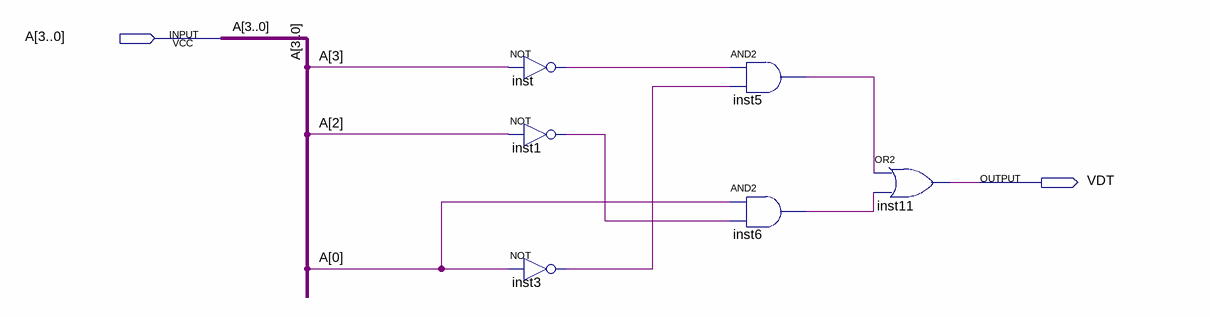
[diagram p0: schematic sheet]
// Quartus schematic assignment5a.bdf as structural Verilog: 6 symbols, 2 pins
module assignment5a (
  input  [3:0] A,
  output VDT
);

  wire inst1_out, inst3_out, inst5_out, inst6_out, inst_out;

  not inst (inst_out, A[3]);
  not inst1 (inst1_out, A[2]);
  not inst3 (inst3_out, A[0]);
  and inst5 (inst5_out, inst_out, inst3_out);
  and inst6 (inst6_out, A[0], inst1_out);
  or inst11 (VDT, inst5_out, inst6_out);
endmodule
